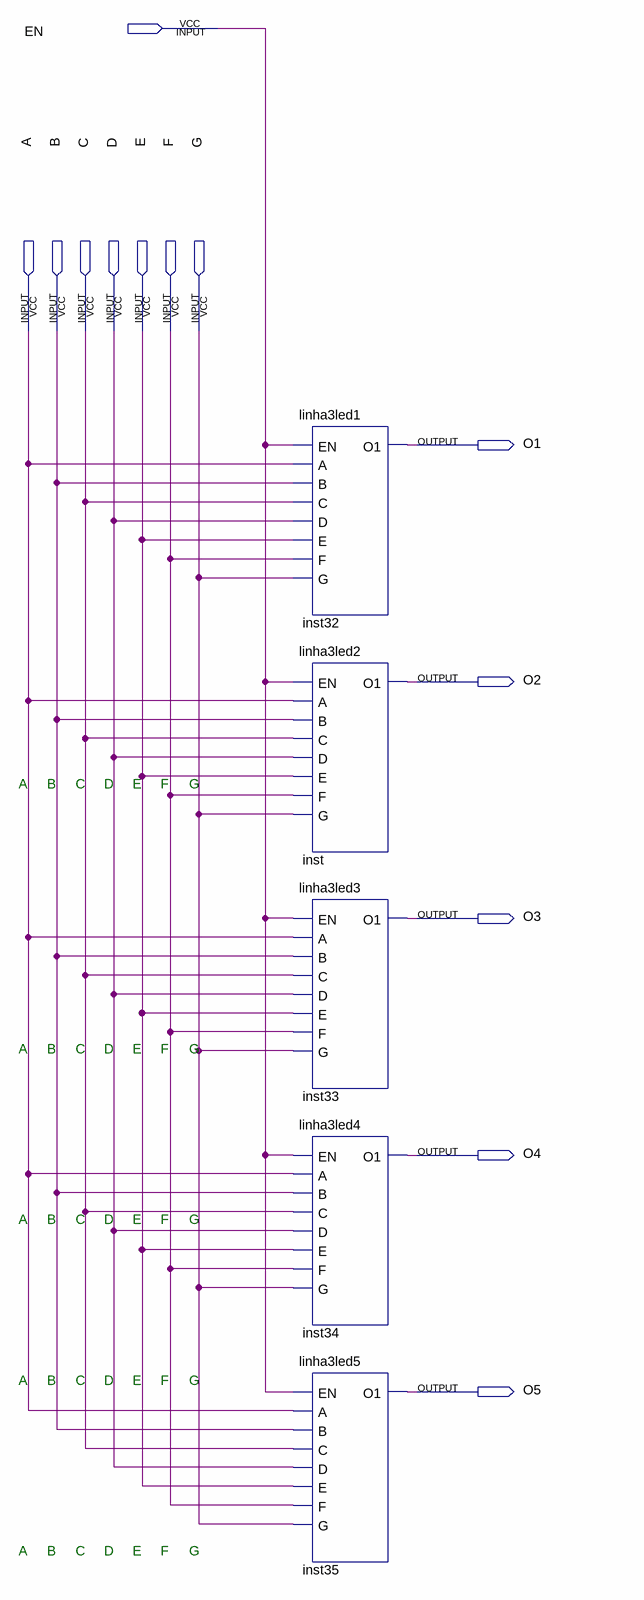
[diagram p0: schematic sheet]
// Quartus schematic linha3.bdf as structural Verilog: 5 symbols, 13 pins
module linha3 (
  input  EN,
  input  A,
  input  B,
  input  C,
  input  D,
  input  E,
  input  F,
  input  G,
  output O1,
  output O2,
  output O3,
  output O4,
  output O5
);

  linha3led1 inst32 (.EN(EN), .A(A), .B(B), .C(C), .D(D), .E(E), .F(F), .G(G), .O1(O1));
  linha3led2 inst (.EN(EN), .A(A), .B(B), .C(C), .D(D), .E(E), .F(F), .G(G), .O1(O2));
  linha3led3 inst33 (.EN(EN), .A(A), .B(B), .C(C), .D(D), .E(E), .F(F), .G(G), .O1(O3));
  linha3led4 inst34 (.EN(EN), .A(A), .B(B), .C(C), .D(D), .E(E), .F(F), .G(G), .O1(O4));
  linha3led5 inst35 (.EN(EN), .A(A), .B(B), .C(C), .D(D), .E(E), .F(F), .G(G), .O1(O5));

  // Notes on the sheet:
  //   A
  //   B
  //   C
  //   D
  //   E
  //   F
  //   G
  //   A
  //   B
  //   C
  //   D
  //   E
  //   F
  //   G
  //   A
  //   B
  //   C
  //   D
  //   E
  //   F
  //   G
  //   A
  //   B
  //   C
  //   D
  //   E
  //   F
  //   G
  //   A
  //   B
  //   C
  //   D
  //   E
  //   F
  //   G
endmodule
